# EAGLE design ques4_assignment2 v1 (EAGLE 9.7.0)
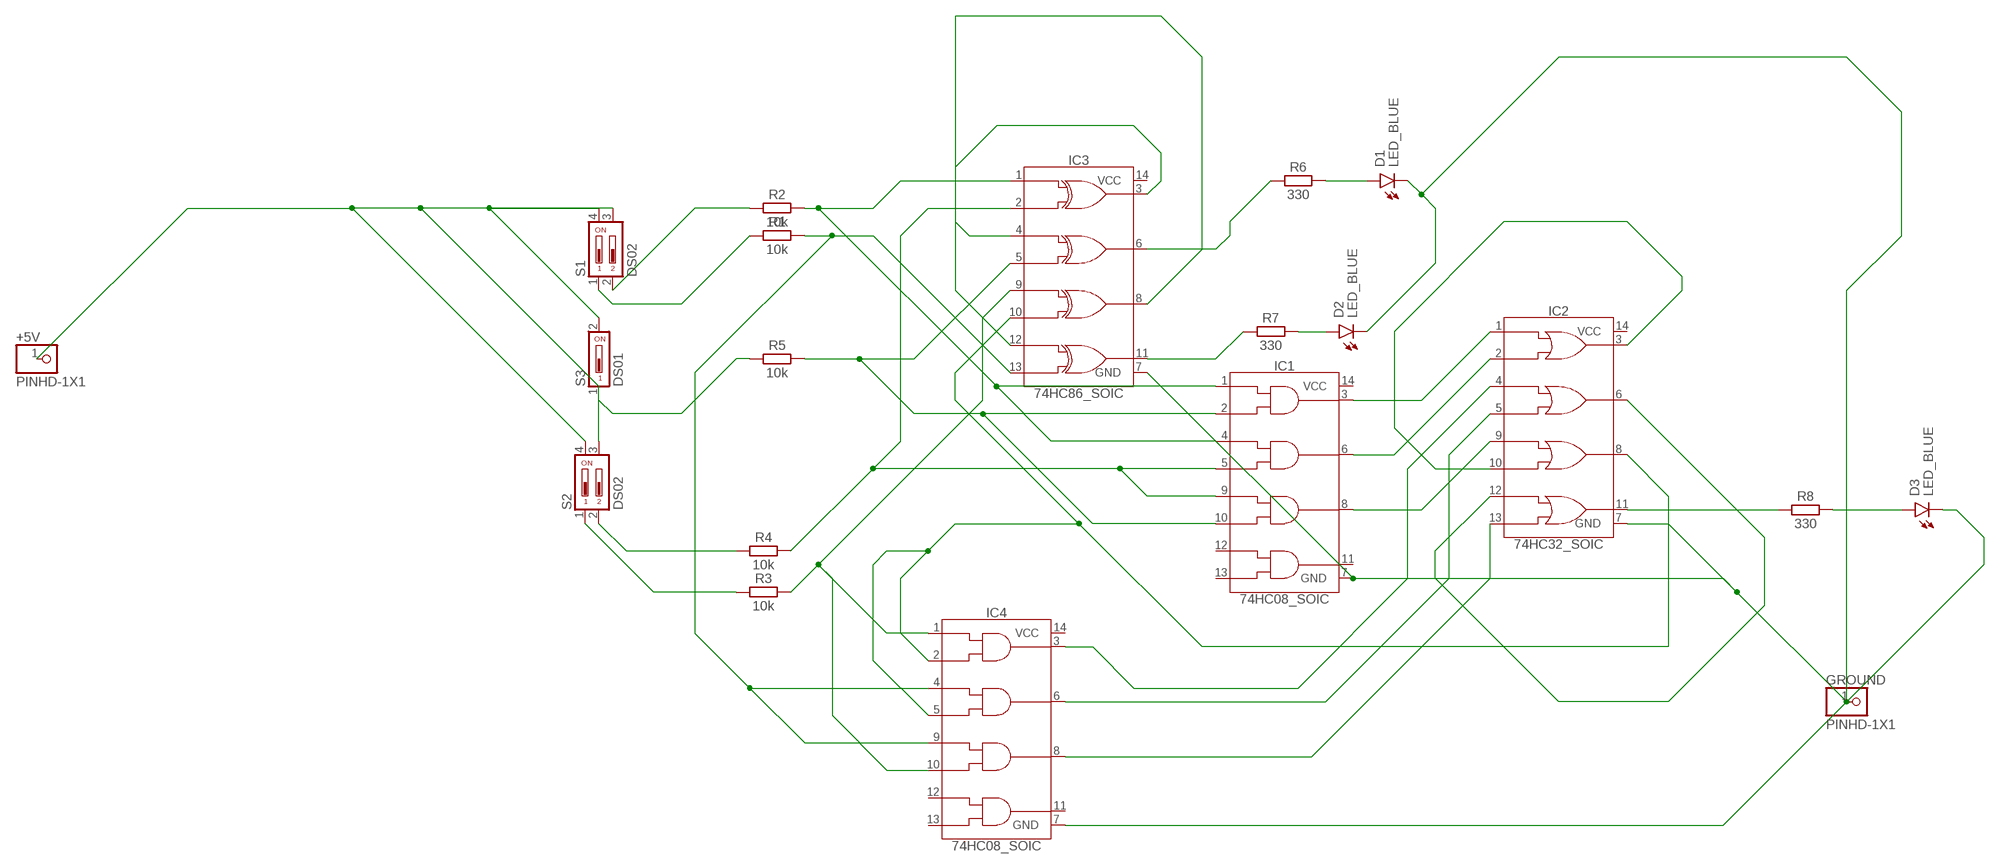
[diagram p0: schematic, sheet 1]

## Parts
+5V  PINHD-1X1  [1X01]
D1  LED_BLUE  CHIP-FLAT-B_0402  [LEDC1005X25N_FLAT-B]
D2  LED_BLUE  CHIP-FLAT-B_0402  [LEDC1005X25N_FLAT-B]
D3  LED_BLUE  CHIP-FLAT-B_0402  [LEDC1005X25N_FLAT-B]
GROUND  PINHD-1X1  [1X01]
IC1  74HC08_SOIC  [SOIC127P600X175-14N]
IC2  74HC32_SOIC  [SOIC127P600X175-14N]
IC3  74HC86_SOIC  [SOIC127P600X175-14N]
IC4  74HC08_SOIC  [SOIC127P600X175-14N]
R1  10k  R_CHIP-0402(1005-METRIC)  [RESC1005X40]
R2  10k  R_CHIP-0402(1005-METRIC)  [RESC1005X40]
R3  10k  R_CHIP-0402(1005-METRIC)  [RESC1005X40]
R4  10k  R_CHIP-0402(1005-METRIC)  [RESC1005X40]
R5  10k  R_CHIP-0402(1005-METRIC)  [RESC1005X40]
R6  330  R_CHIP-0402(1005-METRIC)  [RESC1005X40]
R7  330  R_CHIP-0402(1005-METRIC)  [RESC1005X40]
R8  330  R_CHIP-0402(1005-METRIC)  [RESC1005X40]
S1  DS02  [DS-02]
S2  DS02  [DS-02]
S3  DS01  [DS-01]

## Nets
N$1: R1.1 S1.1
N$2: R2.1 S1.2
N$3: R5.1 S3.1
N$4: R3.1 S2.1
N$5: R4.1 S2.2
N$6: IC1.1(1A) IC1.4(2A) IC3.1(1A) R2.2
N$7: IC1.5(2B) IC1.9(3A) IC3.2(1B) R4.2
N$8: IC3.3(1Y) IC3.4(2A)
N$9: IC1.2(1B) IC1.10(3B) IC3.5(2B) R5.2
N$10: D1.A R6.2
N$11: IC3.6(2Y) R6.1
N$12: IC1.3(1Y) IC2.1(1A)
N$13: IC1.6(2Y) IC2.2(1B)
N$14: IC1.8(3Y) IC2.9(3A)
N$15: IC2.3(1Y) IC2.10(3B)
N$16: IC3.9(3A) IC4.1(1A) IC4.10(3B) R3.2
N$17: IC2.8(3Y) IC3.10(3B) IC4.2(1B) IC4.5(2B)
N$18: IC3.8(3Y) IC3.12(4A)
N$19: IC3.13(4B) IC4.4(2A) IC4.9(3A) R1.2
N$20: IC3.11(4Y) R7.1
N$21: D2.A R7.2
N$22: IC2.4(2A) IC4.3(1Y)
N$23: IC2.5(2B) IC4.6(2Y)
N$24: IC2.6(2Y) IC2.12(4A)
N$25: IC2.13(4B) IC4.8(3Y)
N$26: IC2.11(4Y) R8.1
N$27: D3.A R8.2
N$28: +5V.1 S1.3 S1.4 S2.3 S2.4 S3.2
N$30: D1.C D2.C D3.C GROUND.1 IC1.7(GND) IC2.7(GND) IC3.7(GND) IC4.7(GND)
Unconnected: IC1.11(4Y) IC1.12(4A) IC1.13(4B) IC1.14(VCC) IC2.14(VCC) IC3.14(VCC) IC4.11(4Y) IC4.12(4A) IC4.13(4B) IC4.14(VCC)

## Library data of the parts
+5V GROUND = Connector:PINHD-1X1: PIN HEADER; CATEGORY: CONNECTOR; SUB-CATEGORY: PIN-HEADER
D1-D3 = LED:CHIP-FLAT-B; CATEGORY: LED; COLOR: BLUE; DESCRIPTION: CHIP LED FLAT; SUB-CATEGORY: CHIP; TYPE: FLAT_TOP
IC1 IC4 = IC_Logic:74HC08: Quadruple 2-Input AND Gates Reference Datasheet <https://www.ti.com/lit/ds/symlink/sn74hc08.pdf?ts=1637607755453&ref_url=https%253A%252F%252Fwww.google.com%252F>; CATEGORY: IC_Logic; DESCRIPTION: Quadruple 2-Input AND Gates; MANUFACTURER: Generic; MPN: Generic; SUB-CATEGORY: GATE; TYPE: AND
IC2 = IC_Logic:74HC32: Quadruple 2-Input OR Gates Reference Datasheet <https://www.ti.com/lit/ds/symlink/sn54hc32-sp.pdf?ts=1637578080525&ref_url=https%253A%252F%252Fwww.google.com%252F>; CATEGORY: IC_Logic; DESCRIPTION: Quadruple 2-Input OR Gates; MANUFACTURER: Generic; MPN: Generic; SUB-CATEGORY: GATE; TYPE: OR
IC3 = IC_Logic:74HC86: Quadruple 2-Input XOR Gates Reference Datasheet <https://www.ti.com/lit/ds/symlink/sn74hc86.pdf?ts=1637598937585&ref_url=https%253A%252F%252Fwww.google.com%252F>; CATEGORY: IC_Logic; DESCRIPTION: Quadruple 2-Input XOR; MANUFACTURER: Generic; MPN: Generic; SUB-CATEGORY: GATE; TYPE: XOR
R1-R8 = Resistor:R: Resistor Fixed - Generic; CATEGORY: Resistor; SUB-CATEGORY: Fixed
S1 S2 = Switch:DS02: DIL/CODE SWITCH; CATEGORY: SWITCH; MPN: MCNDS02; TYPE: SPST
S3 = Switch:DS01: DIL/CODE SWITCH; CATEGORY: SWITCH; TYPE: SPST

## Board
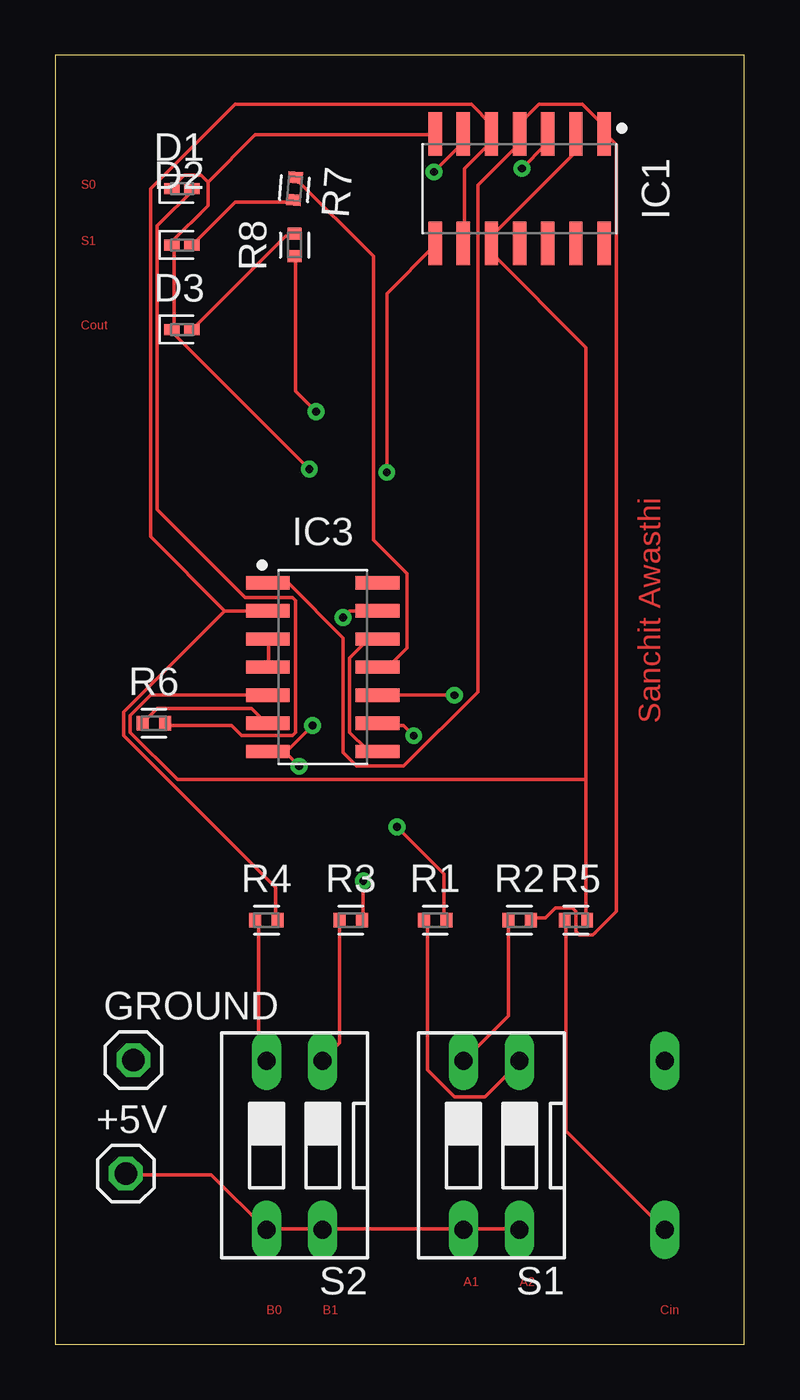
[diagram p1: board, top side]
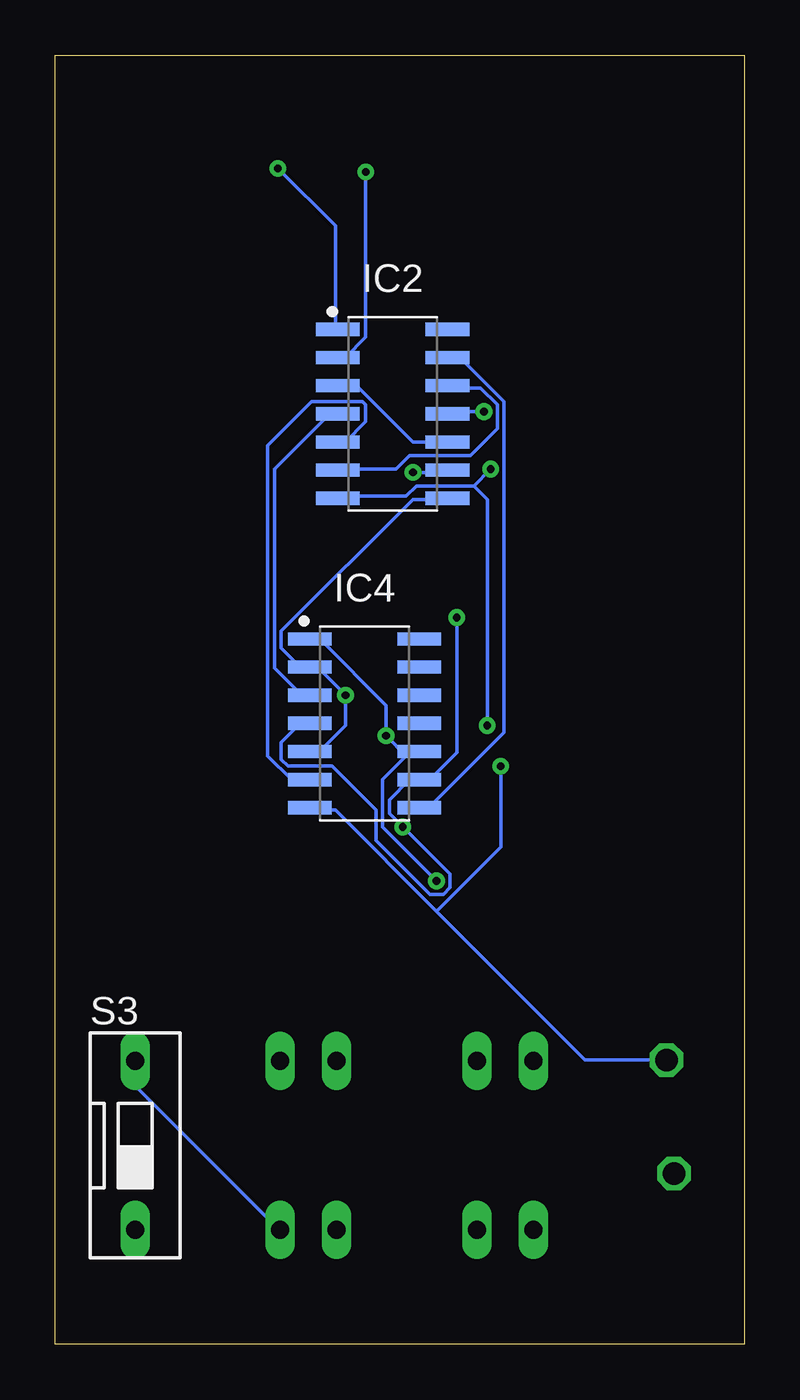
[diagram p2: board, bottom side, seen from below]

Size 31.11 x 58.17 mm. Coordinates in mm from the lower left corner, seen from the top.
Outline: 0,0 31.11,0 31.11,58.17 0,58.17 0,0
Copper layers (1*16): Top / Bottom
Stack-up Default Layer Stack: Top User Defined 0.035mm / Dielectric-1 User Defined 1.5mm / Bottom User Defined 0.035mm
Design rules "default": minimum track width 6mil, minimum drill 0.35mm, track to track 6mil, track to pad 6mil, pad to pad 6mil, via to via 6mil, smd to smd 6mil, copper to edge 40mil, drill to drill 6mil, minimum pad ring 10mil, minimum via ring 8mil, stop-mask expansion 4mil, vias tented up to drill 0mil, thermal gap 10mil

### Footprints (pad centres in the part's own frame; a part is rotated, then mirrored left to right if it is on the bottom)
1X01 = drill 1.016 octagon: 1 0,0
LEDC1005X25N_FLAT-B = smd 0.7 x 0.5: A 0.45,0; C -0.45,0
SOIC127P600X175-14N = smd 1.968 x 0.599: 1 -2.473,3.81; 2 -2.473,2.54; 3 -2.473,1.27; 4 -2.473,0; 5 -2.473,-1.27; 6 -2.473,-2.54; 7 -2.473,-3.81; 8 2.473,-3.81; 9 2.473,-2.54; 10 2.473,-1.27; 11 2.473,0; 12 2.473,1.27; 13 2.473,2.54; 14 2.473,3.81
RESC1005X40 = smd 0.535 x 0.644: 1 -0.507,0; 2 0.507,0
DS-02 = drill 0.813 long: 1 -1.27,-3.81; 2 1.27,-3.81; 3 1.27,3.81; 4 -1.27,3.81
DS-01 = drill 0.813 long: 1 0,-3.81; 2 0,3.81

### Placement (x,y rotation side)
+5V  3.18,7.7 0 top
D1  5.72,52.15 0 top
D2  5.72,49.61 0 top
D3  5.72,45.8 0 top
GROUND  3.52,12.82 0 top
IC1  20.96,52.15 270 top
IC2  15.88,41.99 0 bottom
IC3  12.07,30.56 0 top
IC4  17.15,28.02 0 bottom
R1  17.15,19.13 0 top
R2  20.96,19.13 0 top
R3  13.34,19.13 0 top
R4  9.53,19.13 0 top
R5  23.5,19.13 0 top
R6  4.45,28.02 0 top
R7  10.8,52.15 265.6 top
R8  10.8,49.61 90 top
S1  19.69,8.97 180 top
S2  10.8,8.97 180 top
S3  27.51,8.97 0 bottom

### Tracks (layer width: path | path; a pad name or v marks a point on that pad's centre or on a via)
N$1
  Top 0.152: R1.1 16.79,19.08 16.79,12.37 18.01,11.15 19.39,11.15 20.91,12.68 S1.1
N$2
  Top 0.152: S1.2 20.45,14.81 20.45,19.08 R2.1
N$3
  Top 0.152: S3.1 23.04,9.63 23.04,19.08 R5.1
N$4
  Top 0.152: R3.1 12.83,19.08 12.83,13.59 12.07,12.83 S2.1
N$5
  Top 0.152: S2.2 9.17,13.14 9.17,19.08 R4.1
N$6
  Top 0.152: R2.2 21.52,19.23 22.13,19.23 22.59,19.69 23.35,19.69 23.5,19.54 23.5,18.62 23.65,18.47 24.26,18.47 25.33,19.54 25.33,54.13 24.87,54.59 IC1.1 24.72,54.74 24.72,55.05 23.81,55.96 21.82,55.96 21.06,55.2 21.06,54.74 IC1.4 20.91,54.59 20.91,54.13 19.08,52.3 19.08,29.44 15.73,26.09 13.59,26.09 12.98,26.7 12.98,31.88 10.55,34.32 9.63,34.32 IC3.1
N$7
  Top 0.152: IC1.9 18.47,49.71 18.47,53.06 19.69,54.28 IC1.5 19.69,55.05 18.78,55.96 8.11,55.96 4.3,52.15 4.3,36.45 7.65,33.1 | 7.65,33.1 3.08,28.53 3.08,27.46 9.94,20.6 9.94,19.23 R4.2 | IC3.2 7.65,33.1
N$8
  Top 0.152: IC3.4 9.63,30.66 9.63,31.73 IC3.3
N$9
  Top 0.152: 23.96,25.48 23.96,44.99 19.69,49.25 IC1.10 19.69,50.02 23.5,53.83 IC1.2 | 23.96,25.48 23.96,19.23 R5.2 | IC3.5 4.3,29.29 3.38,28.38 3.38,27.61 5.52,25.48 23.96,25.48
N$10
  Top 0.152: R6.2 5.06,27.92 7.95,27.92 8.41,27.46 10.7,27.46 10.85,27.61 10.85,33.56 10.7,33.71 8.57,33.71 4.6,37.67 4.6,50.47 6.28,52.15 D1.A
N$11
  Top 0.152: R6.1 3.99,28.07 4.6,28.68 8.87,28.68 9.48,28.07 IC3.6
N$12  (via drill 0.35)
  Top 0.152: v21.06,53.06 22.13,54.13 22.13,54.59 IC1.3
  Bottom 0.152: v21.06,53.06 18.47,50.47 18.47,45.9 IC2.1
N$13  (via drill 0.35)
  Top 0.152: v17.1,52.91 18.32,54.13 18.32,54.59 IC1.6
  Bottom 0.152: IC2.2 18.01,44.53 17.1,45.44 v17.1,52.91
N$14  (via drill 0.35)
  Top 0.152: v14.97,39.35 14.97,47.43 17.1,49.56 IC1.8
  Bottom 0.152: v14.97,39.35 13.44,39.35 IC2.9
N$15
  Bottom 0.152: IC2.10 14.97,40.72 17.4,43.16 18.32,43.16 IC2.3
N$16  (via drill 0.35)
  Top 0.152: v13.9,20.91 13.9,19.23 R3.2 | v16.19,27.46 15.73,27.92 14.66,27.92 IC3.9
  Bottom 0.152: v13.9,20.91 16.34,23.35 16.34,25.48 15.27,26.55 | 15.27,26.55 15.12,26.7 14.81,26.7 IC4.10 15.27,26.55 | 15.27,26.55 v16.19,27.46 16.19,28.83 19.08,31.73 19.54,31.73 IC4.1
N$17  (via drill 0.35)
  Top 0.152: v18.01,29.29 IC3.10
  Bottom 0.152: IC4.5 19.54,26.85 19.08,26.85 18.01,27.92 v18.01,29.29 19.23,30.51 19.54,30.51 IC4.2 19.69,30.66 20.15,30.66 20.91,31.42 20.91,32.19 14.97,38.13 13.44,38.13 IC2.8
N$18
  Top 0.152: IC3.8 14.51,26.85 14.05,26.85 13.29,27.61 13.29,30.97 14.05,31.73 14.51,31.73 IC3.12
N$19  (via drill 0.35)
  Top 0.152: v15.42,23.35 17.56,21.21 17.56,19.23 R1.2 | IC3.13 13.29,33.1 v12.98,32.8
  Bottom 0.152: v12.98,32.8 12.98,26.7 14.2,25.48 IC4.9 15.12,25.48 16.03,24.57 16.03,23.96 v15.42,23.35 13.29,21.21 13.29,20.6 13.59,20.3 14.2,20.3 16.64,22.74 16.64,24.11 18.62,26.09 20.6,26.09 20.91,26.39 20.91,27.16 20.15,27.92 19.69,27.92 IC4.4
N$20
  Top 0.152: R7.1 10.85,52.61 14.36,49.1 14.36,36.3 15.88,34.78 15.88,31.42 15.12,30.66 14.66,30.66 IC3.11
N$21
  Top 0.152: R7.2 10.7,51.54 8.11,51.54 6.28,49.71 D2.A
N$22
  Bottom 0.152: IC4.3 20,29.29 21.21,30.51 21.21,39.5 18.78,41.94 18.47,41.94 IC2.4
N$23
  Bottom 0.152: IC2.5 18.01,40.72 17.1,41.63 17.1,42.4 17.25,42.55 19.54,42.55 21.52,40.57 21.52,26.55 20.45,25.48 IC4.6
N$24
  Bottom 0.152: IC2.6 18.32,39.5 15.73,39.5 15.12,40.11 12.38,40.11 11.16,41.33 11.16,42.4 11.92,43.16 13.29,43.16 IC2.12
N$25
  Bottom 0.152: IC2.13 12.83,44.53 10.85,42.55 10.85,27.61 14.2,24.26 14.66,24.26 IC4.8
N$26  (via drill 0.35)
  Top 0.152: v11.77,42.09 10.85,43.01 10.85,49.1 R8.1
  Bottom 0.152: v11.77,42.09 13.29,42.09 IC2.11
N$27
  Top 0.152: R8.2 10.7,50.02 10.39,50.02 6.28,45.9 D3.A
N$28
  Top 0.152: 12.07,5.21 9.63,5.21 S2.3 7.04,7.65 3.23,7.65 +5V.1 | S1.4 20.91,5.21 18.47,5.21 S1.3 18.32,5.21 12.07,5.21 | 12.07,5.21 S2.4
  Bottom 0.152: S3.2 27.46,12.68 27.46,11.61 21.06,5.21 S1.4
N$30  (via drill 0.35)
  Top 0.152: 6.89,52.45 6.58,52.76 5.82,52.76 5.36,52.3 5.36,52.15 D1.C | 6.89,52.45 6.89,51.39 5.21,49.71 D2.C 5.36,49.56 5.36,45.9 D3.C 5.21,45.75 v11.46,39.5 | 6.89,52.45 9.02,54.59 17.1,54.59 IC1.7 | 10.39,26.7 9.63,26.7 IC3.7 10.39,26.7 | v11,26.09 10.39,26.7 | 10.39,26.7 v11.61,27.92
  Bottom 0.152: 12.22,38.74 14.81,38.74 15.27,38.28 18.32,38.28 IC2.7 | v11.46,39.5 12.22,38.74 | 13.9,19.54 7.19,12.83 3.54,12.83 GROUND.1 | 13.9,19.54 18.47,24.11 19.54,24.11 IC4.7 | v11,26.09 11,22.43 13.9,19.54 | 12.22,38.74 11.61,38.13 v11.61,27.92

### Text on the board
Top: S0 | S1 | Cout | Sanchit Awasthi | A1 | A2 | B0 | B1 | Cin